# Altium schematic sheet Anemometor_ResDiv2.SchDoc
size 152 x 101 mm; SheetNumber: 8; SheetTotal: 11
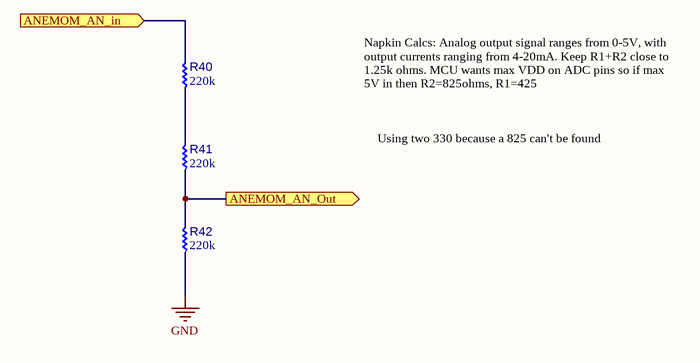
[diagram p0: Anemometor_ResDiv2.SchDoc]

## Parts
R40  value 220k  [New footprint 1]  (hidden comment: RMCF0603FT220K)
R41  value 220k  [New footprint 1]  (hidden comment: RMCF0603FT220K)
R42  value 220k  [New footprint 1]  (hidden comment: RMCF0603FT220K)

## Ports
ANEMOM_AN_in (in, see TopLevel[1A]), ANEMOM_AN_Out (out, see TopLevel[1A])

## Nets
GND: R42.1
ANEMOM_AN_in: R40.2 ; port ANEMOM_AN_in
ANEMOM_AN_Out: R41.1 R42.2 ; port ANEMOM_AN_Out
NetR40_1: R40.1 R41.2

## Notes on the sheet
- Napkin Calcs: Analog output signal ranges from 0-5V, with output currents ranging from 4-20mA. Keep R1+R2 close to 1.25k ohms. MCU wants max VDD on ADC pins so if max 5V in then R2=825ohms, R1=425
- Using two 330 because a 825 can't be found

## Library data of the parts
R40-R42 = CMP-009-00365-1: Res Thick Film 0603 220K Ohm 1% 0.1W(1/10W) ±100ppm/C Pad SMD Automotive T/R; Voltage Rating: 75V; Tolerance: 1%; Min Operating Temperature: -55°C; Mounting Technology: Surface Mount; Case/Package: 0603; Max Operating Temperature: 155°C